# Altium project DC309A.PrjPcb (part 5 of 7)

## Sheet DC309A_CLKGen.SchDoc: CLKGen
size 558 x 431 mm; Date: Not shown in title block; ApprovedBy: Not shown in title block; CheckedBy: Not shown in title block; Author: Not shown in title block; CompanyName: Not shown in title block; DrawnBy: KAVIKANNAN; Engineer: Not shown in title block; Organization: Not shown in title block; Address1: Not shown in title block; Address2: Not shown in title block; Address3: Not shown in title block; Address4: Not shown in title block; DocumentNumber: 7; Revision: Use project parameter SCH_Rev; SheetNumber: 7; SheetTotal: 11; PageSetup: Record=PageOptions|CenterHorizontal=True|CenterVertical=True|PrintScale=1.00|XCorrection=1.00|YCorrection=1.00|PrintKind=0|BorderSize=5000000|LeftOffset=0|BottomOffset=0|Orientation=2|PaperLength=1000|PaperWidth=1000|Scale=100|PaperSource=15|PrintQuality=600|MediaType=1|DitherType=10|PaperKind=Letter|PrintScaleMode=1; CurrentTime: Not shown in title block; CurrentDate: Not shown in title block; Time: Not shown in title block; DocumentFullPathAndName: Not shown in title block; DocumentName: Not shown in title block; ModifiedDate: Not shown in title block; ImagePath: Not shown in title block
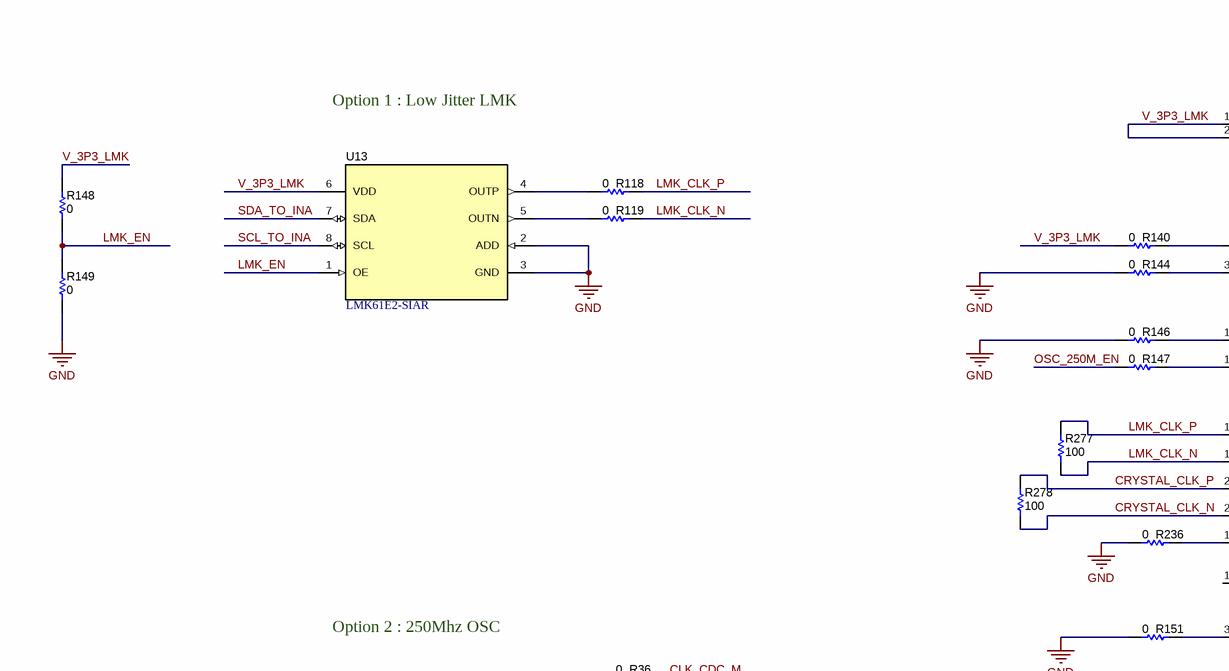
[diagram p20: DC309A_CLKGen.SchDoc, top left]
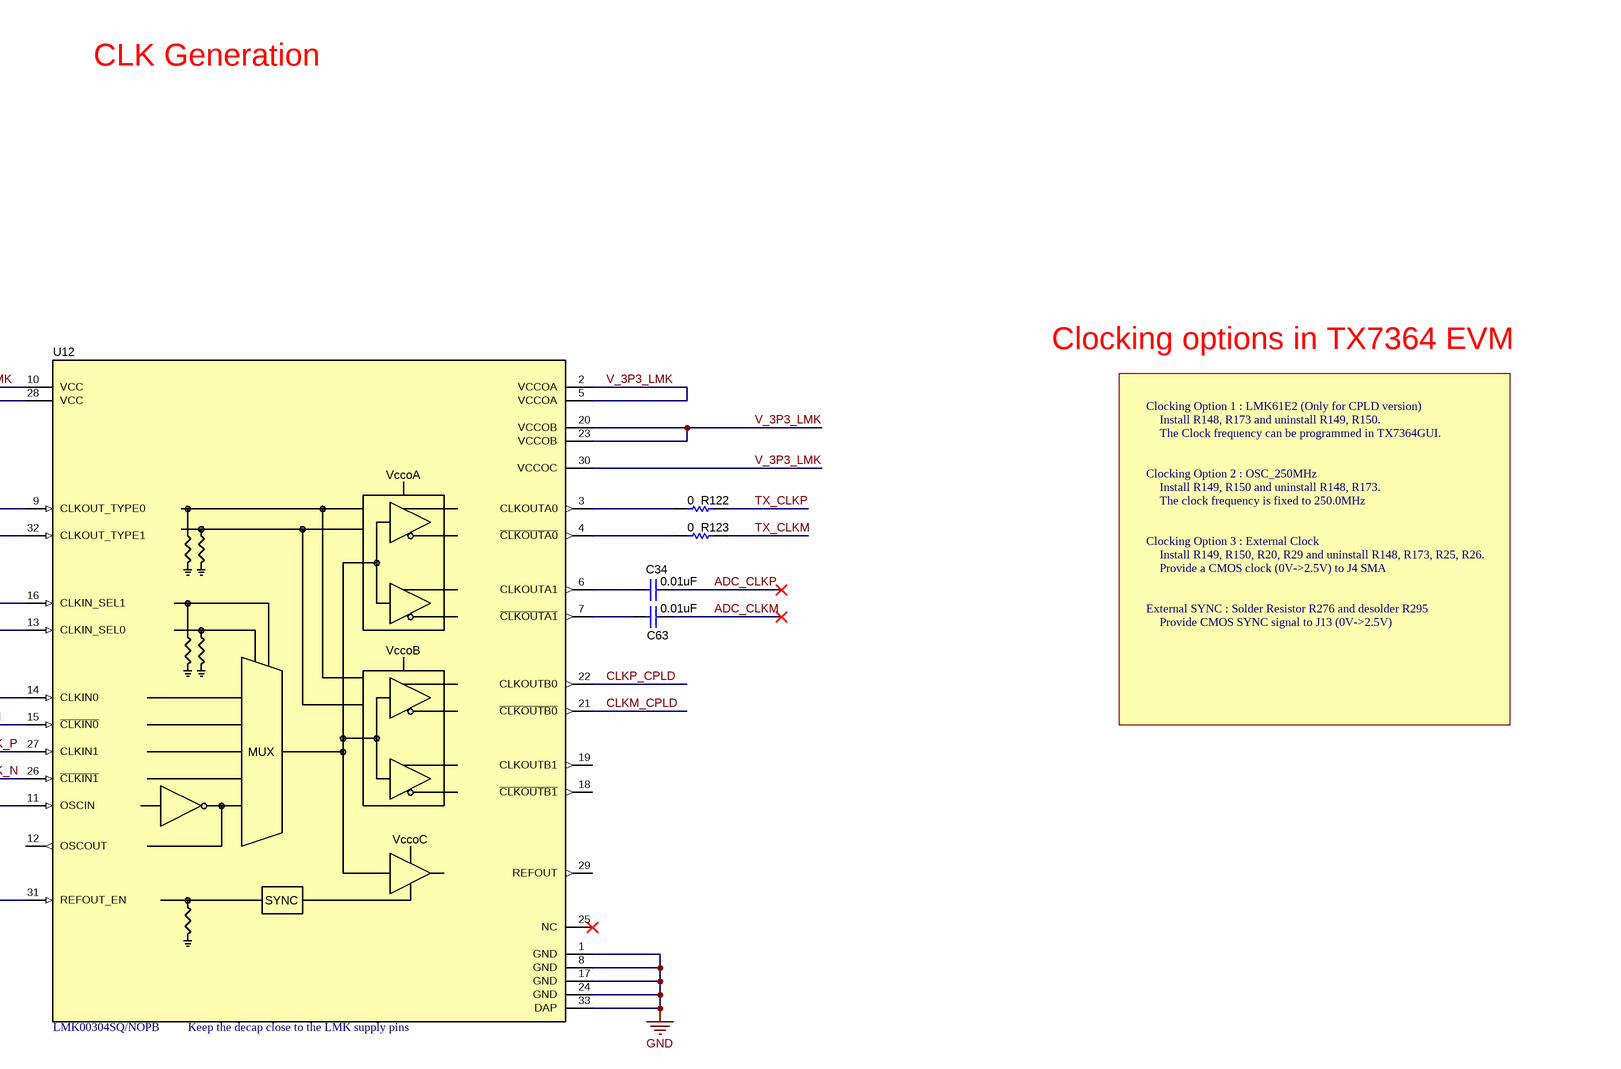
[diagram p21: DC309A_CLKGen.SchDoc, top right]
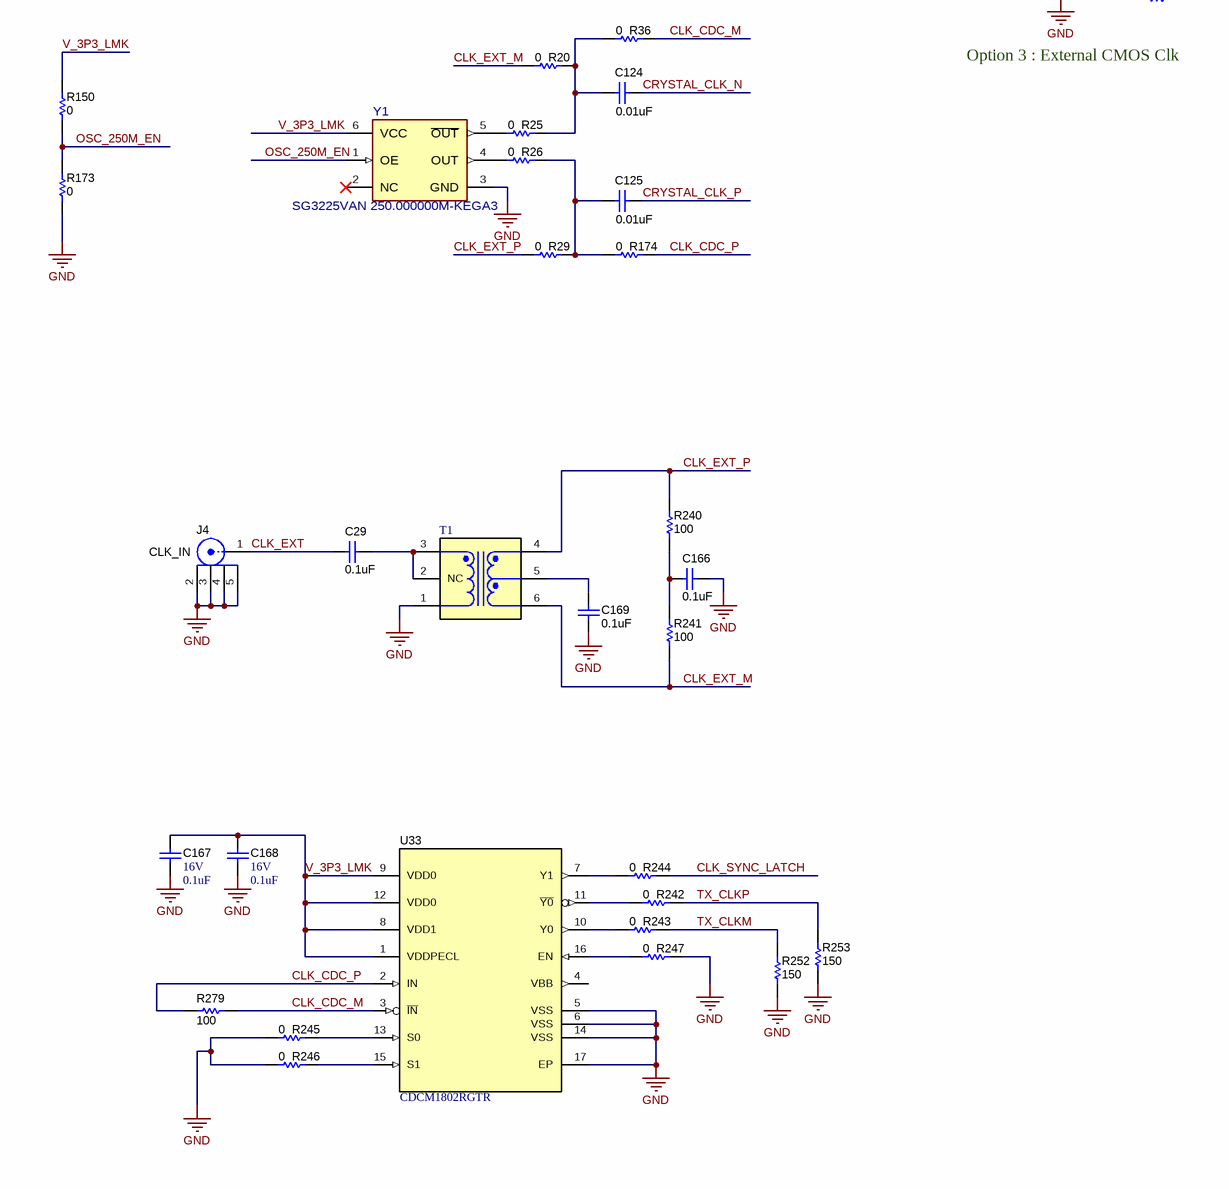
[diagram p22: DC309A_CLKGen.SchDoc, bottom left]
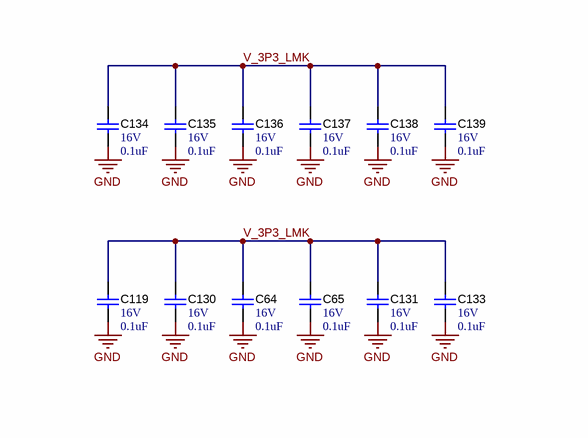
[diagram p23: DC309A_CLKGen.SchDoc, bottom right]

### Parts
C29  ValueDisplayed: 0.1uF  [0402]  (hidden comment: Capacitor)
C34  ValueDisplayed: 0.01uF  [0402_065]  (hidden comment: 520L103KT16T)
C63  ValueDisplayed: 0.01uF  [0402_065]  (hidden comment: 520L103KT16T)
C64  VDC_V: 16V  ValueDisplayed: 0.1uF  [0402]  (hidden comment: 0402YC104KAT2A)
C65  VDC_V: 16V  ValueDisplayed: 0.1uF  [0402]  (hidden comment: 0402YC104KAT2A)
C119  VDC_V: 16V  ValueDisplayed: 0.1uF  [0402]  (hidden comment: 0402YC104KAT2A)
C124  ValueDisplayed: 0.01uF  [0402_065]  (hidden comment: 520L103KT16T)
C125  ValueDisplayed: 0.01uF  [0402_065]  (hidden comment: 520L103KT16T)
C130  VDC_V: 16V  ValueDisplayed: 0.1uF  [0402]  (hidden comment: 0402YC104KAT2A)
C131  VDC_V: 16V  ValueDisplayed: 0.1uF  [0402]  (hidden comment: 0402YC104KAT2A)
C133  VDC_V: 16V  ValueDisplayed: 0.1uF  [0402]  (hidden comment: 0402YC104KAT2A)
C134  VDC_V: 16V  ValueDisplayed: 0.1uF  [0402]  (hidden comment: 0402YC104KAT2A)
C135  VDC_V: 16V  ValueDisplayed: 0.1uF  [0402]  (hidden comment: 0402YC104KAT2A)
C136  VDC_V: 16V  ValueDisplayed: 0.1uF  [0402]  (hidden comment: 0402YC104KAT2A)
C137  VDC_V: 16V  ValueDisplayed: 0.1uF  [0402]  (hidden comment: 0402YC104KAT2A)
C138  VDC_V: 16V  ValueDisplayed: 0.1uF  [0402]  (hidden comment: 0402YC104KAT2A)
C139  VDC_V: 16V  ValueDisplayed: 0.1uF  [0402]  (hidden comment: 0402YC104KAT2A)
C166  ValueDisplayed: 0.1uF  [0402]  (hidden comment: Capacitor)
C167  VDC_V: 16V  ValueDisplayed: 0.1uF  [0402]  (hidden comment: 0402YC104KAT2A)
C168  VDC_V: 16V  ValueDisplayed: 0.1uF  [0402]  (hidden comment: 0402YC104KAT2A)
C169  ValueDisplayed: 0.1uF  [0402]  (hidden comment: Capacitor)
J4  901-144-8RFX  [AMPHENOL_901-144-8RFX]  (value not drawn)
R20  Res_ohm: 0  [0402]  (hidden comment: Resistor)
R25  Res_ohm: 0  [0402]  (hidden comment: Resistor)
R26  Res_ohm: 0  [0402]  (hidden comment: Resistor)
R29  Res_ohm: 0  [0402]  (hidden comment: Resistor)
R36  Res_ohm: 0  [0402]  (hidden comment: Resistor)
R118  Res_ohm: 0  [0402]  (hidden comment: Resistor)
R119  Res_ohm: 0  [0402]  (hidden comment: Resistor)
R122  Res_ohm: 0  [0402]  (hidden comment: Resistor)
R123  Res_ohm: 0  [0402]  (hidden comment: Resistor)
R140  Res_ohm: 0  [0402]  (hidden comment: Resistor)
R144  Res_ohm: 0  [0402]  (hidden comment: Resistor)
R146  Res_ohm: 0  [0402]  (hidden comment: Resistor)
R147  Res_ohm: 0  [0402]  (hidden comment: Resistor)
R148  Res_ohm: 0  [0402]  (hidden comment: Resistor)
R149  Res_ohm: 0  [0402]  (hidden comment: Resistor)
R150  Res_ohm: 0  [0402]  (hidden comment: Resistor)
R151  Res_ohm: 0  [0402]  (hidden comment: Resistor)
R173  Res_ohm: 0  [0402]  (hidden comment: Resistor)
R174  Res_ohm: 0  [0402]  (hidden comment: Resistor)
R236  Res_ohm: 0  [0402]  (hidden comment: Resistor)
R240  ValueDisplayed: 100  [0402]  (hidden comment: Resistor)
R241  ValueDisplayed: 100  [0402]  (hidden comment: Resistor)
R242  Res_ohm: 0  [0402]  (hidden comment: Resistor)
R243  Res_ohm: 0  [0402]  (hidden comment: Resistor)
R244  Res_ohm: 0  [0402]  (hidden comment: Resistor)
R245  Res_ohm: 0  [0402]  (hidden comment: Resistor)
R246  Res_ohm: 0  [0402]  (hidden comment: Resistor)
R247  Res_ohm: 0  [0402]  (hidden comment: Resistor)
R252  ValueDisplayed: 150  [0603]  (hidden comment: RT0603BRD07150RL)
R253  ValueDisplayed: 150  [0603]  (hidden comment: RT0603BRD07150RL)
R277  ValueDisplayed: 100  [0402]  (hidden comment: Resistor)
R278  ValueDisplayed: 100  [0402]  (hidden comment: Resistor)
R279  ValueDisplayed: 100  [0402]  (hidden comment: Resistor)
T1  MNC_ADT4-1WT+  [MNC_CD542]  (value not drawn)
U12  LMK00304SQ/NOPB  [RTV0032A]
U13  LMK61E2-SIAR  [SIA0008B]
U33  CDCM1802RGTR  [RGT0016A]
Y1  SG3225VAN 250.000000M-KEGA3  [FP-SG3225VAN 250.000000M-KEGA3_XTAL_SMD_3MM2_2MM5-MFG]

### Nets
GND: C64.2 C65.2 C119.2 C130.2 C131.2 C133.2 C134.2 C135.2 C136.2 C137.2 C138.2 C139.2 C166.1 C167.2 C168.2 C169.1 J4.2 J4.3 J4.4 J4.5 R144.1 R146.1 R149.1 R151.1 R173.1 R236.1 R245.1 R246.1 R247.2 R252.1 R253.1 T1.1 U12.1(GND) U12.8(GND) U12.17(GND) U12.24(GND) U12.33(DAP) U13.2(ADD) U13.3(GND) U33.5(VSS) U33.6(VSS) U33.14(VSS) U33.17(EP) Y1.3(GND)
ADC_CLKM: C63.1
ADC_CLKP: C34.1
CLK_CDC_M: R36.2 R279.2 U33.3(~{IN})
CLK_CDC_P: R174.2 R279.1 U33.2(IN)
CLK_EXT: C29.1 J4.1
CLK_EXT_M: R20.1 R241.1 T1.6
CLK_EXT_P: R29.1 R240.2 T1.4
CLK_SYNC_LATCH: R244.2
CLKM_CPLD: U12.21(~{CLKOUTB0})
CLKP_CPLD: U12.22(CLKOUTB0)
CRYSTAL_CLK_N: C124.1 R278.1 U12.26(~{CLKIN1})
CRYSTAL_CLK_P: C125.1 R278.2 U12.27(CLKIN1)
LMK_CLK_N: R119.2 R277.1 U12.15(~{CLKIN0})
LMK_CLK_P: R118.2 R277.2 U12.14(CLKIN0)
LMK_EN: R148.1 R149.2 U13.1(OE)
OSC_250M_EN: R147.1 R150.1 R173.2 Y1.1(OE)
SCL_TO_INA: U13.8(SCL)
SDA_TO_INA: U13.7(SDA)
TX_CLKM: R123.2 R243.2 R252.2
TX_CLKP: R122.2 R242.2 R253.2
V_3P3_LMK: C64.1 C65.1 C119.1 C130.1 C131.1 C133.1 C134.1 C135.1 C136.1 C137.1 C138.1 C139.1 C167.1 C168.1 R140.1 R148.2 R150.2 U12.2(VCCOA) U12.5(VCCOA) U12.10(VCC) U12.20(VCCOB) U12.23(VCCOB) U12.28(VCC) U12.30(VCCOC) U13.6(VDD) U33.1(VDDPECL) U33.8(VDD1) U33.9(VDD0) U33.12(VDD0) Y1.6(VCC)
NetC29_2: C29.2 T1.2(NC) T1.3
NetC34_2: C34.2 U12.6(CLKOUTA1)
NetC63_2: C63.2 U12.7(~{CLKOUTA1})
NetC124_2: C124.2 R20.2 R25.2 R36.1
NetC125_2: C125.2 R26.2 R29.2 R174.1
NetC166_2: C166.2 R240.1 R241.2
NetC169_2: C169.2 T1.5
NetR25_1: R25.1 Y1.5(~{OUT})
NetR26_1: R26.1 Y1.4(OUT)
NetR118_1: R118.1 U13.4(OUTP)
NetR119_1: R119.1 U13.5(OUTN)
NetR122_1: R122.1 U12.3(CLKOUTA0)
NetR123_1: R123.1 U12.4(~{CLKOUTA0})
NetR140_2: R140.2 U12.9(CLKOUT_TYPE0)
NetR144_2: R144.2 U12.32(CLKOUT_TYPE1)
NetR146_2: R146.2 U12.16(CLKIN_SEL1)
NetR147_2: R147.2 U12.13(CLKIN_SEL0)
NetR151_2: R151.2 U12.31(REFOUT_EN)
NetR236_2: R236.2 U12.11(OSCIN)
NetR242_1: R242.1 U33.11(~{Y0})
NetR243_1: R243.1 U33.10(Y0)
NetR244_1: R244.1 U33.7(Y1)
NetR245_2: R245.2 U33.13(S0)
NetR246_2: R246.2 U33.15(S1)
NetR247_1: R247.1 U33.16(EN)

Not connected (* = marked no-connect by the designer): U12 12(OSCOUT) 18(~{CLKOUTB1}) 19(CLKOUTB1) 25(NC)* 29(REFOUT); U33 4(VBB); Y1 2(NC)*

### Notes on the sheet
- CLK Generation
- Option 1 : Low Jitter LMK
- Clocking options in TX7364 EVM
- Clocking Option 1 : LMK61E2 (Only for CPLD version)
- Install R148, R173 and uninstall R149, R150.
- The Clock frequency can be programmed in TX7364GUI.
- Clocking Option 2 : OSC_250MHz
- Install R149, R150 and uninstall R148, R173.
- The clock frequency is fixed to 250.0MHz
- Clocking Option 3 : External Clock
- Install R149, R150, R20, R29 and uninstall R148, R173, R25, R26.
- Provide a CMOS clock (0V->2.5V) to J4 SMA
- External SYNC : Solder Resistor R276 and desolder R295
- Provide CMOS SYNC signal to J13 (0V->2.5V)
- Option 2 : 250Mhz OSC
- Option 3 : External CMOS Clk
- (near U12) Keep the decap close to the LMK supply pins
- (near J4) CLK_IN
- Drawn By:
- SVN Rev:
- Number:
- TID #:
- Orderable:
- Rev:
- Sheet Title:
- File:
- Project Title:
- Designed for:
- Assembly Variant:
- Mod. Date:
- Sheet:
- Size:
- of
- C
- http://www.ti.com
- Texas Instruments and/or its licensors do not warrant the accuracy or completeness of this specification or any information contained therein. Texas Instruments and/or its licensors do not warrant that this design will meet the specifications, will be suitable for your application or fit for any particular purpose, or will operate in an implementation. Texas Instruments and/or its licensors do not warrant that the design is production worthy. You should completely validate and test your design implementation to confirm the system functionality for your application.
- Engineer:
- Contact:
- © Texas Instruments
- (in symbol CMP-0065665-2) MUX; SYNC

### Library data of the parts
C29 C166 C169 = CMP-0006255-2: CAP, CERM, 0.1 uF, 6.3 V, +/- 10%, X5R, 0402; PartNumber: C1005X5R0J104K050BA; Manufacturer: TDK; Polarized: N; Value: 0.1uF; U/M: EA; Cap_F: 100nF; ESR_ohm: 0.0186; Value1: 0.0186 ohm; VDC_V: 6.3V; TaMin_C: -55°C; TaMax_C: 85°C; SizeArea_mm2: 0.5; SizeAreaWB_mm2: 3; SizeX_mm: 1; SizeZ_mm: 0.6; AEC Category: Q200; CompType: Capacitor; PackageReference: 0402; RoHS: Y; Tolerance_%: 10%; Value2: 6.3V; MountType: SMT; Technology: Ceramic; TempCo: X5R; Cap_Case: 0402; SizeY_mm: 0.5; Published: 2008-06-19; Publisher: Texas Instruments; LatestRevisionDate: 2017-03-09; ComponentLink1Description: Datasheet link; ComponentLink1URL: http://www.tdk.co.jp/tefe02/e412_c.pdf; Supplier 1: Digi-Key; Supplier Part Number 1: 445-1266-1-ND; Supplier 2: Newark; Supplier Part Number 2: 90R7579; Supplier 3: Mouser; Supplier Part Number 3: 810-C1005X5R0J104K; AEC Qualified: ?
C34 C63 C124 C125 = CMP-0006210-2: CAP, CERM, 0.01 uF, 16 V, +/- 10%, X7R, 0402; Manufacturer: AT Ceramics; TaMin_C: -55°C; Polarized: N; SizeAreaWB_mm2: 3; Value1: Unknown; U/M: EA; Value: 0.01uF; TaMax_C: 125°C; SizeZ_mm: 0.65; SizeX_mm: 1; SizeY_mm: 0.5; Cap_Case: 0402; Value2: 16V; CompType: Capacitor; Cap_F: 10nF; AEC Category: Q200; Supplier Part Number 2: 581-520L103KT16T; Publisher: Texas Instruments; Supplier 2: Mouser; TempCo: X7R; Published: 2008-06-19; RoHS: Y; MountType: SMT; Supplier 1: Digi-Key; PackageReference: 0402; Tolerance_%: 10%; SizeArea_mm2: 0.5; LatestRevisionDate: 2017-03-09; PartNumber: 520L103KT16T; AEC Qualified: N; VDC_V: 16V; ComponentLink1Description: Datasheet link; AEC Grade: N/A; Supplier Part Number 1: 1284-1540-1-ND; Technology: Ceramic; ComponentLink1URL: https://www.atceramics.com/UserFiles/520l.pdf
C64 C65 C119 C130 C131 C133-C139 C167 C168 = CMP-0006201-2: CAP, CERM, 0.1 uF, 16 V, +/- 10%, X7R, 0402; Manufacturer: AVX; TaMin_C: -55°C; Polarized: N; SizeAreaWB_mm2: 3; Value1: Unknown; U/M: EA; Value: 0.1uF; TaMax_C: 125°C; SizeZ_mm: 0.6; SizeX_mm: 1; SizeY_mm: 0.5; Cap_F: 100nF; AEC Category: Q200; ComponentLink1URL: http://catalogs.avx.com/SurfaceMount.pdf; Supplier Part Number 2: 09R7024; Publisher: Texas Instruments; Supplier 2: Newark; Supplier Part Number 3: 581-0402YC104KAT2A; TempCo: X7R; Supplier 3: Mouser; Published: 2008-06-19; RoHS: Y; MountType: SMT; Supplier 1: Digi-Key; PackageReference: 0402; Tolerance_%: 10%; Cap_Case: 0402; Value2: 16V; SizeArea_mm2: 0.5; CompType: Capacitor; LatestRevisionDate: 2017-03-09; PartNumber: 0402YC104KAT2A; AEC Qualified: N; ComponentLink1Description: Datasheet link; AEC Grade: N/A; Supplier Part Number 1: 478-7888-1-ND; Technology: Ceramic
J4 = CMP-0055833-1: SMA Straight Jack, Gold, 50 Ohm, TH; Manufacturer: Amphenol RF; CNHeader: FALSE; Green_Lifecycle: Not Set; Green_REACh: Incomplete; CT: TRUE; ComponentLink1URL: http://www.amphenolinfocom.eu/NavData/Drawings/C901-144-8RFX.pdf; Supplier Part Number 2: 34C8151; Publisher: Texas Instruments; Supplier 2: Newark; Supplier Part Number 3: 523-901-144-8RFX; Supplier 3: Mouser; RoHS: Y; MountType: TH; Green_EU RoHS-2: Incomplete; Supplier 1: Digi-Key; Green_EU RoHS: Incomplete; PackageReference: SMA Straight Jack, TH; CompType: SMA; LatestRevisionDate: 26/05/2017; PartNumber: 901-144-8RFX; ComponentLink1Description: Datasheet URL; Supplier Part Number 1: ARFX1231-ND
R20 R25 R26 R29 R36 R118 R119 R122 R123 R140 R144 R146-R151 R173 R174 R236 R242-R247 = CMP-0026992-3: RES, 0, 5%, 0.1 W, AEC-Q200 Grade 0, 0402; PartNumber: ERJ-2GE0R00X; Manufacturer: Panasonic; Value_Code: 0000; Power_W: 100mW; Value2: 0.1W; VDC_V: 50V; TempCo: 600 ppm/C; SizeArea_mm2: 0.5; SizeX_mm: 1; SizeZ_mm: 0.6; EIA_Code: E24; AEC Category: Q200; AEC Qualified: Y; SizeAreaWB_mm2: 3; CompType: Resistor; PackageReference: 0402; RoHS: Y; Tolerance_%: 5%; Value1: 5%; MountType: SMT; Technology: Thick Film; SizeY_mm: 0.5; ComponentLink1Description: Datasheet link; ComponentLink1URL: https://industrial.panasonic.com/cdbs/www-data/pdf/RDA0000/AOA0000C301.pdf; Supplier 1: Digi-Key; Supplier Part Number 1: P0.0JCT-ND; Supplier 2: Newark; Supplier Part Number 2: 65T8307; Supplier 3: Mouser; Supplier Part Number 3: 667-ERJ-2GE0R00X; AEC Grade: 0; ValueDisplayed: 0
R240 R241 R277-R279 = CMP-0026993-2: RES, 100, 5%, 0.1 W, AEC-Q200 Grade 0, 0402; PartNumber: ERJ-2GEJ101X; Manufacturer: Panasonic; Value: 100; Value_Code: 100R; Power_W: 100mW; Value2: 0.1W; TempCo: 200 ppm/C; SizeArea_mm2: 0.5; SizeX_mm: 1; SizeZ_mm: 0.6; EIA_Code: E24; U/M: EA; AEC Category: Q200; AEC Qualified: Y; AEC Grade: 0; CompType: Resistor; PackageReference: 0402; RoHS: Y; Res_ohm: 100; Tolerance_%: 5%; Value1: 5%; MountType: SMT; Technology: Thick Film; SizeY_mm: 0.5; Published: 2008-06-26; Publisher: Texas Instruments; LatestRevisionDate: 2017-03-09; ComponentLink1Description: Datasheet link; ComponentLink1URL: https://industrial.panasonic.com/cdbs/www-data/pdf/RDA0000/AOA0000C84.pdf; Supplier 1: Digi-Key; Supplier Part Number 1: P100JCT-ND; Supplier 2: Newark; Supplier Part Number 2: 65T8246; Supplier 3: Farnell; Supplier Part Number 3: 2059210
R252 R253 = CMP-0023767-2: RES, 150, 0.1%, 0.1 W, 0603; Manufacturer: Yageo America; Power_W: 100mW; TempCo: 25 ppm/C; Value_Code: 150R; U/M: EA; Value: 150; EIA_Code: E192; SizeX_mm: 1.6; SizeY_mm: 0.8; SizeZ_mm: 1; Value2: 0.1W; SizeArea_mm2: 1.28; VDC_V: 75V; AEC Category: Q200; Publisher: Texas Instruments; Published: 2008-06-26; RoHS: Y; Value1: 0.1%; MountType: SMT; PackageReference: 0603; Tolerance_%: 0.1%; Res_ohm: 150; CompType: Resistor; LatestRevisionDate: 2017-03-09; PartNumber: RT0603BRD07150RL; AEC Qualified: ?; ComponentLink1Description: Datasheet link; Technology: Thin Film; ComponentLink1URL: http://www.yageo.com/pdf/PYu-RT_1-to-0.05_RoHS_L_3.pdf
T1 = CMP-0030461-2: RF Transformer, 50 ohm, 2 to 775 MHz, SMT; Manufacturer: Minicircuits; Green_Lifecycle: Not Set; Green_REACh: Incomplete; PartNumber: ADT4-1WT+; MountType: SMT; PackageReference: CD542; RoHS: Y; ComponentLink1URL: http://www.minicircuits.com/pdfs/ADT4-1WT.pdf; ComponentLink1Description: Datasheet URL; CompType: Transformer; Publisher: Texas Instruments; LatestRevisionDate: 2017-05-09; Green_EU RoHS-2: Incomplete; Green_EU RoHS: Incomplete
U12 = CMP-0065665-2: 3.1-GHz Differential Clock Buffer/Level Translator, RTV0032A (WQFN-32); Alternate Manufacturer: Texas Instruments; SizeAreaWB_mm2: 49.0; SizeArea_mm2: 25.0; SizeX_mm: 5.0; Green_REACh: Passed; SizeZ_mm: 0.8; AEC Category: Q200; Green_Lifecycle: Active; CompType: IC; AEC Qualified: N; ComponentLink1Description: Datasheet Link; ComponentLink2URL: http://www.ti.com/product/lmk00304; PartNumber: LMK00304SQ/NOPB; ComponentLink3Description: Online Datasheet; ComponentLink1URL: http://www.ti.com/lit/ds/symlink/lmk00304.pdf; PackageReference: RTV0032A; ComponentLink2Description: Product Folder; Green_EU RoHS-2: Passed; RoHS: Y; Green_EU RoHS: Passed; ComponentLink3URL: http://www.ti.com/product/lmk00304/datasheet; PackageDescription: WQFN-32; Operating Temperature Range: -40 to 85 C; SizeY_mm: 5.0; Manufacturer: Texas Instruments; MountType: SMT
U13 = CMP-0075884-1: Ultra-Low Jitter Fully Programmable Oscillator, Integrated EEPROM, +/-50ppm, SIA0008B (QFM-8); Manufacturer: Texas Instruments; Alternate PartNumber: LMK61E2-SIAT; SizeAreaWB_mm2: 20.25; SizeArea_mm2: 12.25; SizeZ_mm: 2.0; SizeY_mm: 3.5; U/M: EA; CompType: IC; ComponentLink1Description: Datasheet Link; RoHS: Y; PackageReference: SIA0008B; PartNumber: LMK61E2-SIAR; Publisher: Texas Instruments; PackageDescription: QFM-8; Alternate Manufacturer: Texas Instruments; ComponentLink1URL: http://www.ti.com/lit/ds/symlink/lmk61e2.pdf; LatestRevisionDate: 2017-06-09; MountType: SMT; SizeX_mm: 3.5
U33 = CMP-0065659-2: Clock Buffer w/Programmable Divider, LVPECL I/O + addl LVCMOS output, RGT0016A (VQFN-16); Alternate PartNumber: CDCM1802RGTT; Alternate Manufacturer: Texas Instruments; SizeAreaWB_mm2: 25.0; U/M: EA; SizeZ_mm: 1.0; SizeX_mm: 4.0; SizeArea_mm2: 16.0; CompType: IC; ComponentLink1URL: http://www.ti.com/lit/ds/symlink/cdcm1802.pdf; Publisher: Texas Instruments; PackageDescription: VQFN-16; RoHS: Y; MountType: SMT; Manufacturer: Texas Instruments; PackageReference: RGT0016A; SizeY_mm: 4.0; LatestRevisionDate: 2017-06-09; PartNumber: CDCM1802RGTR; ComponentLink1Description: Datasheet Link
Y1 = CMP-0087650-1: XTAL OSC XO 250.0000MHZ LVDS SMD; Manufacturer: EPSON; AEC Qualified: No; Frequency_Fixed: 250MHz; SizeZ_mm: 1.2mm; ComponentLink1Description: Datasheet; RoHS: TRUE; PartNumber: SG3225VAN 250.000000M-KEGA3; Symbol Name: SYM-SG3225VAN 250.000000M-KEGA3; ComponentLink1URL: https://support.epson.biz/td/api/doc_check.php?dl=brief_SG5032VAN&lang=en; PackageReference: XTAL_SMD_3MM2_2MM5

## Sheet DC309A_External_Sync.SchDoc: External_Sync
size 558 x 431 mm; Date: Not shown in title block; ApprovedBy: Not shown in title block; CheckedBy: Not shown in title block; Author: Not shown in title block; CompanyName: Not shown in title block; DrawnBy: KAVIKANNAN; Engineer: Not shown in title block; Organization: Not shown in title block; Address1: Not shown in title block; Address2: Not shown in title block; Address3: Not shown in title block; Address4: Not shown in title block; DocumentNumber: 8; Revision: Use project parameter SCH_Rev; SheetNumber: 8; SheetTotal: 11; PageSetup: Record=PageOptions|CenterHorizontal=True|CenterVertical=True|PrintScale=1.00|XCorrection=1.00|YCorrection=1.00|PrintKind=0|BorderSize=5000000|LeftOffset=0|BottomOffset=0|Orientation=2|PaperLength=1000|PaperWidth=1000|Scale=100|PaperSource=15|PrintQuality=600|MediaType=1|DitherType=10|PaperKind=Letter|PrintScaleMode=1; CurrentTime: Not shown in title block; CurrentDate: Not shown in title block; Time: Not shown in title block; DocumentFullPathAndName: Not shown in title block; DocumentName: Not shown in title block; ModifiedDate: Not shown in title block; ImagePath: Not shown in title block
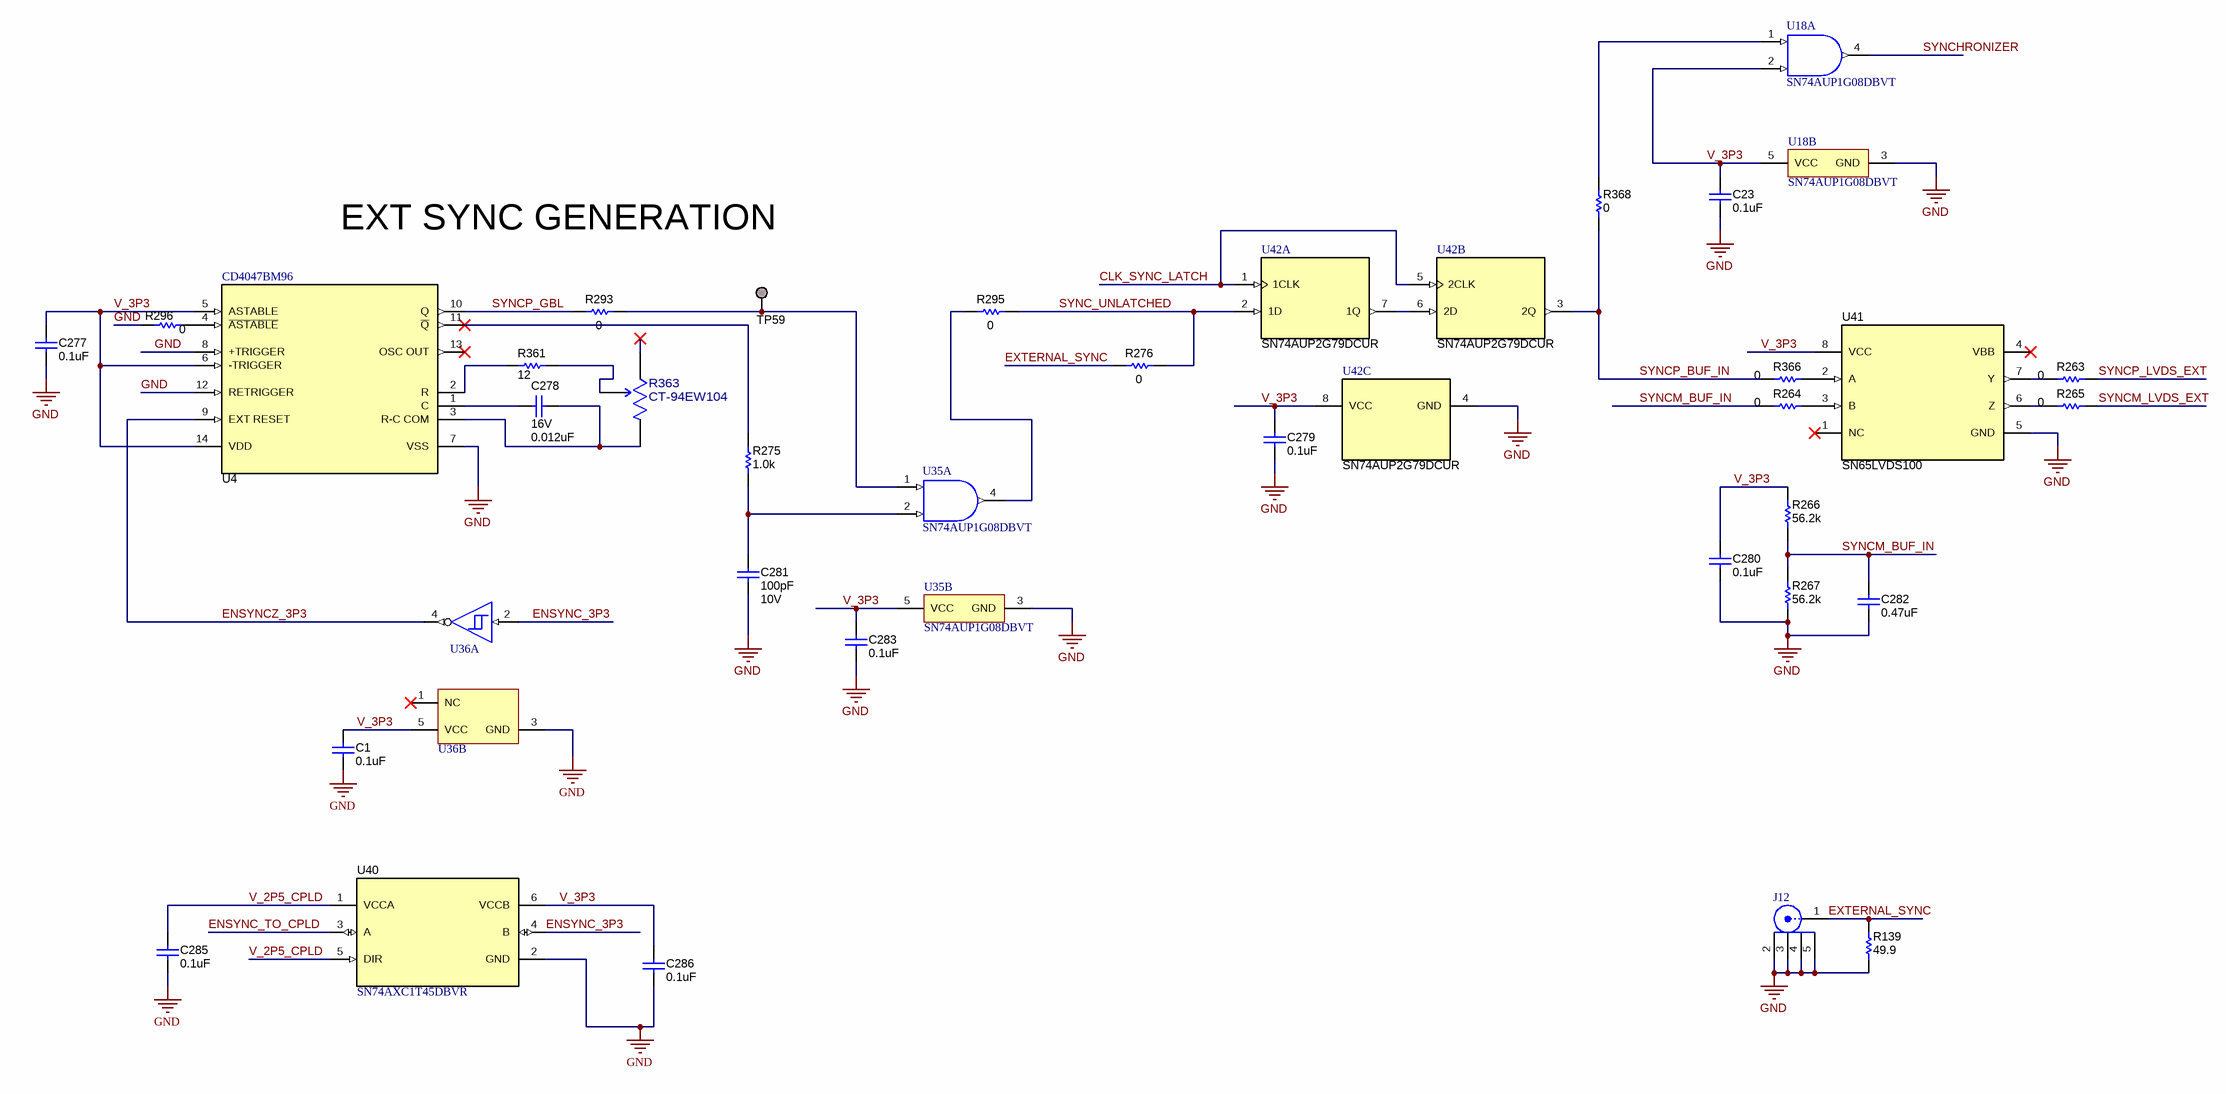
[diagram p24: DC309A_External_Sync.SchDoc]

### Parts
C1  value 0.1uF  [0402]  (hidden comment: Capacitor)
C23  ValueDisplayed: 0.1uF  [0402]  (hidden comment: Capacitor)
C277  ValueDisplayed: 0.1uF  [0402]  (hidden comment: Capacitor)
C278  VDC_V: 16V  ValueDisplayed: 0.012uF  [0402]  (hidden comment: GRM155R71C123KA01D)
C279  ValueDisplayed: 0.1uF  [0402]  (hidden comment: Capacitor)
C280  ValueDisplayed: 0.1uF  [0402]  (hidden comment: Capacitor)
C281  Cap_F: 100pF  VDC_V: 10V  [0603]  (hidden comment: 0603ZC101KAT2A)
C282  ValueDisplayed: 0.47uF  [0402]  (hidden comment: Capacitor)
C283  ValueDisplayed: 0.1uF  [0402]  (hidden comment: Capacitor)
C285  value 0.1uF  [0402]  (hidden comment: Capacitor)
C286  value 0.1uF  [0402]  (hidden comment: Capacitor)
J12  901-144-8RFX  [AMPHENOL_901-144-8RFX]  (value not drawn)
R139  ValueDisplayed: 49.9  [TNPW0603]  (hidden comment: TNPW060349R9BEEA)
R263  value 0  [0402]  (hidden comment: Resistor)
R264  value 0  [0402]  (hidden comment: Resistor)
R265  value 0  [0402]  (hidden comment: Resistor)
R266  ValueDisplayed: 56.2k  [0402]  (hidden comment: Resistor)
R267  ValueDisplayed: 56.2k  [0402]  (hidden comment: Resistor)
R275  ValueDisplayed: 1.0k  [0402]  (hidden comment: CRCW04021K00JNED)
R276  value 0  [0402]  (hidden comment: Resistor)
R293  value 0  [0402]  (hidden comment: Resistor)
R295  value 0  [0402]  (hidden comment: Resistor)
R296  ValueDisplayed: 0  [0402]  (hidden comment: Resistor)
R361  ValueDisplayed: 12  [0402]  (hidden comment: CRCW040212R0JNED)
R363  CT-94EW104  [FP-CT-94EW104_PTH_POTEN_9MM6_4MM8-MFG]
R366  value 0  [0402]  (hidden comment: Resistor)
R368  value 0  [0402]  (hidden comment: Resistor)
TP59  Test Point  [TP_50MIL-SMT]  (value not drawn)  (no BOM)
U4  CD4047BM96  [D0014A_N]
U18  SN74AUP1G08DBVT  [DBV0005A_N]  (parts A,B of 2)
U35  SN74AUP1G08DBVT  [DBV0005A_N]  (parts A,B of 2)
U36  SN74LVC1G14DBVR  [DBV0005A_N]  (value not drawn)  (parts A,B of 2)
U40  SN74AXC1T45DBVR  [DBV0006A_N]
U41  SN65LVDS100  [DGK0008A_N]
U42  SN74AUP2G79DCUR  [DCU0008A_N]  (parts A,B,C of 3)

### Nets
GND: C1.1 C23.2 C277.2 C279.2 C280.2 C281.1 C282.2 C283.2 C285.1 C286.1 J12.2 J12.3 J12.4 J12.5 R139.1 R267.1 R296.1 U4.7(VSS) U4.8(+TRIGGER) U4.12(RETRIGGER) U18.3(GND) U35.3(GND) U36.3(GND) U40.2(GND) U41.5(GND) U42.4(GND)
V_3P3: C1.2 C23.1 C277.1 C279.1 C280.1 C283.1 C286.2 R266.2 U4.5(ASTABLE) U4.6(-TRIGGER) U4.14(VDD) U18.2(B) U18.5(VCC) U35.5(VCC) U36.5(VCC) U40.6(VCCB) U41.8(VCC) U42.8(VCC)
CLK_SYNC_LATCH: U42.1(1CLK) U42.5(2CLK)
ENSYNC_3P3: U36.2(A) U40.4(B)
ENSYNC_TO_CPLD: U40.3(A)
ENSYNCZ_3P3: U4.9(EXT_RESET) U36.4(Y)
EXTERNAL_SYNC: J12.1 R139.2 R276.2
SYNC_UNLATCHED: R276.1 R295.1 U42.2(1D)
SYNCHRONIZER: U18.4(Y)
SYNCM_BUF_IN: C282.1 R264.2 R266.1 R267.2
SYNCM_LVDS_EXT: R265.1
SYNCP_BUF_IN: R366.2 R368.1 U42.3(2Q)
SYNCP_GBL: R293.2 U4.10(Q)
SYNCP_LVDS_EXT: R263.1
V_2P5_CPLD: C285.2 U40.1(VCCA) U40.5(DIR)
NetC278_1: C278.1 R363.3 U4.3(R-C_COM)
NetC278_2: C278.2 U4.1(C)
NetC281_2: C281.2 R275.2 U35.2(B)
NetR263_2: R263.2 U41.7(Y)
NetR264_1: R264.1 U41.3(B)
NetR265_2: R265.2 U41.6(Z)
NetR275_1: R275.1 U4.11(~{Q})
NetR293_1: R293.1 TP59.1 U35.1(A)
NetR295_2: R295.2 U35.4(Y)
NetR296_2: R296.2 U4.4(~{ASTABLE})
NetR361_1: R361.1 U4.2(R)
NetR361_2: R361.2 R363.2
NetR366_1: R366.1 U41.2(A)
NetR368_2: R368.2 U18.1(A)
NetU42_6: U42.6(2D) U42.7(1Q)

Not connected (* = marked no-connect by the designer): R363 1*; U4 13(OSC_OUT)*; U36 1(NC)*; U41 1(NC)* 4(VBB)*

### Notes on the sheet
- EXT SYNC GENERATION
- Drawn By:
- SVN Rev:
- Number:
- TID #:
- Orderable:
- Rev:
- Sheet Title:
- File:
- Project Title:
- Designed for:
- Assembly Variant:
- Mod. Date:
- Sheet:
- Size:
- of
- C
- http://www.ti.com
- Texas Instruments and/or its licensors do not warrant the accuracy or completeness of this specification or any information contained therein. Texas Instruments and/or its licensors do not warrant that this design will meet the specifications, will be suitable for your application or fit for any particular purpose, or will operate in an implementation. Texas Instruments and/or its licensors do not warrant that the design is production worthy. You should completely validate and test your design implementation to confirm the system functionality for your application.
- Engineer:
- Contact:
- © Texas Instruments

### Library data of the parts
C1 C285 C286 = CMP-0006641-2: CAP, CERM, 0.1 uF, 16 V, +/- 10%, X7R, 0402; PartNumber: GRM155R71C104KA88D; Manufacturer: MuRata; Polarized: N; U/M: EA; Cap_F: 100nF; Value1: Unknown; VDC_V: 16V; TaMin_C: -55°C; TaMax_C: 125°C; AEC Category: Q200; SizeArea_mm2: 0.5; SizeAreaWB_mm2: 3; SizeX_mm: 1; SizeZ_mm: 0.6; CompType: Capacitor; PackageReference: 0402; RoHS: Y; MountType: SMT; ComponentLink1Description: Datasheet link; ComponentLink1URL: http://search.murata.co.jp/Ceramy/PnsearchViewAction.do?HnOFG=ON&HnNFG=ON&SEL_CNT=50&sLang=en&sKey=GRM155R71C104KA88D&x=9&y=9&search=startwith; ValueDisplayed: 0.1uF; Tolerance_%: 10%; Value2: 16V; Technology: Ceramic; TempCo: X7R; Cap_Case: 0402; Published: 2008-06-19; Publisher: Texas Instruments; LatestRevisionDate: 2017-03-09; Supplier 1: Digi-Key; Supplier Part Number 1: 490-3261-1-ND; Supplier 2: Newark; Supplier Part Number 2: 38K1647; Supplier 3: Mouser; Supplier Part Number 3: 81-GRM155R71C104KA88; AEC Qualified: ?; SizeY_mm: 0.5
C23 C279 C280 C283 = CMP-0006201-2: CAP, CERM, 0.1 uF, 16 V, +/- 10%, X7R, 0402; PartNumber: 0402YC104KAT2A; Manufacturer: AVX; Polarized: N; Value: 0.1uF; U/M: EA; Cap_F: 100nF; Value1: Unknown; VDC_V: 16V; TaMin_C: -55°C; TaMax_C: 125°C; SizeArea_mm2: 0.5; SizeAreaWB_mm2: 3; SizeX_mm: 1; SizeZ_mm: 0.6; AEC Category: Q200; CompType: Capacitor; PackageReference: 0402; RoHS: Y; Tolerance_%: 10%; Value2: 16V; MountType: SMT; Technology: Ceramic; TempCo: X7R; Cap_Case: 0402; SizeY_mm: 0.5; Published: 2008-06-19; Publisher: Texas Instruments; LatestRevisionDate: 2017-03-09; ComponentLink1Description: Datasheet link; ComponentLink1URL: http://catalogs.avx.com/SurfaceMount.pdf; Supplier 1: Digi-Key; Supplier Part Number 1: 478-7888-1-ND; Supplier 2: Newark; Supplier Part Number 2: 09R7024; Supplier 3: Mouser; Supplier Part Number 3: 581-0402YC104KAT2A; AEC Qualified: N; AEC Grade: N/A
C277 = CMP-0006255-2: as C29 on sheet DC309A_CLKGen; CompType: Capacitor; PackageReference: 0402; RoHS: Y; Tolerance_%: 10%; Value2: 6.3V; MountType: SMT; Technology: Ceramic; TempCo: X5R; Cap_Case: 0402; SizeY_mm: 0.5; Published: 2008-06-19; Publisher: Texas Instruments; LatestRevisionDate: 2017-03-09; ComponentLink1Description: Datasheet link; ComponentLink1URL: http://www.tdk.co.jp/tefe02/e412_c.pdf; Supplier 1: Digi-Key; Supplier Part Number 1: 445-1266-1-ND; Supplier 2: Newark; Supplier Part Number 2: 90R7579; Supplier 3: Mouser; Supplier Part Number 3: 810-C1005X5R0J104K; AEC Qualified: ?
C278 = CMP-0006642-2: CAP, CERM, 0.012 uF, 16 V, +/- 10%, X7R, 0402; Manufacturer: MuRata; TaMin_C: -55°C; Polarized: N; SizeAreaWB_mm2: 3; Value1: Unknown; U/M: EA; TaMax_C: 125°C; SizeZ_mm: 0.6; SizeX_mm: 1; SizeY_mm: 0.5; Cap_F: 12nF; AEC Category: Q200; Supplier Part Number 2: 81-GRM155R71C123KA1D; Publisher: Texas Instruments; Supplier 2: Mouser; TempCo: X7R; Published: 2008-06-19; RoHS: Y; MountType: SMT; Value: 0.012uF; Supplier 1: Digi-Key; PackageReference: 0402; Tolerance_%: 10%; Cap_Case: 0402; Value2: 16V; SizeArea_mm2: 0.5; CompType: Capacitor; LatestRevisionDate: 2017-03-09; PartNumber: GRM155R71C123KA01D; AEC Qualified: ?; ComponentLink1Description: Datasheet link; Supplier Part Number 1: 490-3255-1-ND; Technology: Ceramic; ComponentLink1URL: http://search.murata.co.jp/Ceramy/PnsearchViewAction.do?HnOFG=ON&HnNFG=ON&SEL_CNT=50&sLang=en&sKey=GRM155R71C123KA01D&x=9&y=9&search=startwith
C281 = CMP-0006812-2: CAP, CERM, 100 pF, 10 V, +/- 10%, X7R, 0603; Manufacturer: AVX; TaMin_C: -55°C; Polarized: N; SizeAreaWB_mm2: 4.68; Value1: Unknown; U/M: EA; Value: 100pF; TaMax_C: 125°C; SizeZ_mm: 1; SizeX_mm: 1.6; SizeY_mm: 0.8; SizeArea_mm2: 1.28; AEC Category: Q200; Supplier Part Number 2: 55J2751; Publisher: Texas Instruments; Supplier 2: Newark; Supplier Part Number 3: 581-0603ZC101KAT2A; TempCo: X7R; Supplier 3: Mouser; Published: 2008-06-19; RoHS: Y; MountType: SMT; Supplier 1: Digi-Key; PackageReference: 0603; Tolerance_%: 10%; Cap_Case: 0603; Value2: 10V; CompType: Capacitor; LatestRevisionDate: 2017-03-09; PartNumber: 0603ZC101KAT2A; AEC Qualified: N; ComponentLink1Description: Datasheet link; AEC Grade: N/A; Supplier Part Number 1: 0603ZC101KAT2A-ND; Technology: Ceramic; ValueDisplayed: 100pF; ComponentLink1URL: http://datasheets.avx.com/X7RDielectric.pdf
C282 = CMP-0006199-2: CAP, CERM, 0.47 uF, 6.3 V, +/- 10%, X5R, 0402; PartNumber: 04026D474KAT2A; Manufacturer: AVX; Polarized: N; Value: 0.47uF; U/M: EA; Cap_F: 470nF; Value1: Unknown; VDC_V: 6.3V; TaMin_C: -55°C; TaMax_C: 85°C; SizeArea_mm2: 0.5; SizeAreaWB_mm2: 3; SizeX_mm: 1; SizeZ_mm: 0.6; AEC Category: Q200; CompType: Capacitor; PackageReference: 0402; RoHS: Y; Tolerance_%: 10%; Value2: 6.3V; MountType: SMT; Technology: Ceramic; TempCo: X5R; Cap_Case: 0402; SizeY_mm: 0.5; Published: 2008-06-19; Publisher: Texas Instruments; LatestRevisionDate: 2017-03-09; ComponentLink1Description: Datasheet link; ComponentLink1URL: http://catalogs.avx.com/SurfaceMount.pdf; Supplier 1: Digi-Key; Supplier Part Number 1: 478-6196-1-ND; Supplier 2: Newark; Supplier Part Number 2: 60R6163; Supplier 3: Mouser; Supplier Part Number 3: 581-04026D474KAT2A; AEC Qualified: N; AEC Grade: N/A
J12 = CMP-0055833-1: as J4 on sheet DC309A_CLKGen; ComponentLink1URL: http://www.amphenolinfocom.eu/NavData/Drawings/C901-144-8RFX.pdf; Supplier Part Number 2: 34C8151; Publisher: Texas Instruments; Supplier 2: Newark; Supplier Part Number 3: 523-901-144-8RFX; Supplier 3: Mouser; RoHS: Y; MountType: TH; Green_EU RoHS-2: Incomplete; Supplier 1: Digi-Key; Green_EU RoHS: Incomplete; PackageReference: SMA Straight Jack, TH; CompType: SMA; LatestRevisionDate: 26/05/2017; PartNumber: 901-144-8RFX; ComponentLink1Description: Datasheet URL; Supplier Part Number 1: ARFX1231-ND
R139 = CMP-0025693-1: RES, 49.9, 0.1%, 0.1 W, AEC-Q200 Grade 1, 0603; Manufacturer: Vishay-Dale; Power_W: 100mW; TempCo: 25 ppm/C; Value_Code: 49R9; U/M: EA; Value: 49.9; EIA_Code: E192; SizeX_mm: 1.6; SizeY_mm: 0.85; SizeZ_mm: 0.55; Value2: 0.1W; SizeArea_mm2: 1.36; AEC Qualified: Y; VDC_V: 75V; AEC Grade: 1; AEC Category: Q200; ComponentLink1URL: http://www.vishay.com/docs/28758/tnpw_e3.pdf; Supplier Part Number 2: 05R4782; Publisher: Texas Instruments; Supplier 2: Newark; Supplier Part Number 3: 71-TNPW060349R9BEEA; Supplier 3: Mouser; Published: 2008-06-26; RoHS: Y; Value1: 0.1%; MountType: SMT; Supplier 1: Digi-Key; PackageReference: 0603; Tolerance_%: 0.1%; Res_ohm: 49.9; CompType: Resistor; LatestRevisionDate: 2017-03-09; PartNumber: TNPW060349R9BEEA; ComponentLink1Description: Datasheet link; Supplier Part Number 1: 541-2031-1-ND; Technology: Thin Film
R263-R265 R276 R293 R295 R366 R368 = CMP-0026992-3: as R20 on sheet DC309A_CLKGen; CompType: Resistor; PackageReference: 0402; RoHS: Y; Res_ohm: 0; Tolerance_%: 5%; Value1: 5%; MountType: SMT; Technology: Thick Film; SizeY_mm: 0.5; ComponentLink1Description: Datasheet link; ComponentLink1URL: https://industrial.panasonic.com/cdbs/www-data/pdf/RDA0000/AOA0000C301.pdf; Supplier 1: Digi-Key; Supplier Part Number 1: P0.0JCT-ND; Supplier 2: Newark; Supplier Part Number 2: 65T8307; Supplier 3: Mouser; Supplier Part Number 3: 667-ERJ-2GE0R00X; AEC Grade: 0; ValueDisplayed: 0
R266 R267 = CMP-0026453-2: RES, 56.2 k, 1%, 0.063 W, AEC-Q200 Grade 0, 0402; PartNumber: CRCW040256K2FKED; Manufacturer: Vishay-Dale; Value: 56.2k; Value_Code: 56k2; Power_W: 63mW; Value2: 0.063W; VDC_V: 50V; TempCo: 100 ppm/C; SizeArea_mm2: 0.5; SizeX_mm: 1; SizeZ_mm: 0.6; EIA_Code: E96; AEC Category: Q200; AEC Qualified: Y; AEC Grade: 0; CompType: Resistor; PackageReference: 0402; RoHS: E; Res_ohm: 56.2k; Tolerance_%: 1%; Value1: 1%; MountType: SMT; Technology: Thick Film; SizeY_mm: 0.5; ComponentLink1Description: Datasheet link; ComponentLink1URL: http://www.vishay.com/docs/20035/dcrcwe3.pdf; Supplier 1: Digi-Key; Supplier Part Number 1: 541-56.2KLCT-ND; Supplier 2: Newark; Supplier Part Number 2: 52K7159; Supplier 3: Mouser; Supplier Part Number 3: 71-CRCW0402-56.2K-E3
R275 = CMP-0026852-1: RES, 1.0 k, 5%, 0.063 W, 0402; Manufacturer: Vishay-Dale; Power_W: 63mW; TempCo: 200 ppm/C; Value_Code: 1k00; U/M: EA; Value: 1.0k; EIA_Code: E24; Res_ohm: 1k; SizeX_mm: 1; SizeY_mm: 0.5; SizeZ_mm: 0.6; Value2: 0.063W; VDC_V: 50V; AEC Category: Q200; ComponentLink1URL: http://www.vishay.com/docs/20035/dcrcwe3.pdf; Supplier Part Number 2: 59M6691; Publisher: Texas Instruments; Supplier 2: Newark; Supplier Part Number 3: 71-CRCW0402J-1.0K-E3; Supplier 3: Mouser; Published: 2008-06-26; RoHS: Y; Value1: 5%; MountType: SMT; Supplier 1: Digi-Key; PackageReference: 0402; Tolerance_%: 5%; SizeArea_mm2: 0.5; CompType: Resistor; LatestRevisionDate: 2017-03-09; PartNumber: CRCW04021K00JNED; AEC Qualified: ?; ComponentLink1Description: Datasheet link; Supplier Part Number 1: 541-1.0KJCT-ND; Technology: Thick Film
R296 = CMP-0026822-3: RES, 0, 5%, 0.063 W, AEC-Q200 Grade 0, 0402; PartNumber: CRCW04020000Z0ED; Manufacturer: Vishay-Dale; Value: 0; Value_Code: 0000; Power_W: 63mW; Value2: 0.063W; VDC_V: 50V; TempCo: 200 ppm/C; EIA_Code: E24; AEC Category: Q200; AEC Qualified: Y; SizeArea_mm2: 0.5; SizeX_mm: 1; SizeZ_mm: 0.6; CompType: Resistor; PackageReference: 0402; RoHS: E; Res_ohm: 0; Tolerance_%: 5%; Value1: 5%; MountType: SMT; Technology: Thick Film; ComponentLink1Description: Datasheet link; ComponentLink1URL: http://www.vishay.com/docs/20035/dcrcwe3.pdf; Supplier 1: Digi-Key; Supplier Part Number 1: 541-0.0JCT-ND; Supplier 2: Newark; Supplier Part Number 2: 52K6543; Supplier 3: Mouser; Supplier Part Number 3: 71-CRCW0402-0-E3; AEC Grade: 0; SizeY_mm: 0.5
R361 = CMP-0026835-3: RES, 12, 5%, 0.063 W, AEC-Q200 Grade 0, 0402; Manufacturer: Vishay-Dale; Power_W: 63mW; TempCo: 200 ppm/C; Value_Code: 12R0; Value: 12; EIA_Code: E24; SizeX_mm: 1; SizeY_mm: 0.5; SizeZ_mm: 0.6; Value2: 0.063W; AEC Qualified: Y; VDC_V: 50V; AEC Category: Q200; AEC Grade: 0; Supplier Part Number 2: 59M6701; Supplier 2: Newark; Supplier Part Number 3: 71-CRCW0402J-12-E3; Supplier 3: Mouser; RoHS: E; Value1: 5%; MountType: SMT; Supplier 1: Digi-Key; PackageReference: 0402; Tolerance_%: 5%; Res_ohm: 12; SizeArea_mm2: 0.5; CompType: Resistor; PartNumber: CRCW040212R0JNED; ComponentLink1Description: Datasheet link; Supplier Part Number 1: 541-12JCT-ND; Technology: Thick Film; ComponentLink1URL: http://www.vishay.com/docs/20035/dcrcwe3.pdf
R363 = CMP-0119977-1: 100 kOhms 0.5W, 1/2W PC Pins Through Hole Trimmer Potentiometer Cermet 18.0 Turn Top Adjustment; Manufacturer: Nidec Components; SizeZ_mm: 11.3mm; Value: 100kΩ; AEC Qualified: No; TempCo: 100ppm/°C; Tolerance_%: 10%; VDC_V: 300V; PackageReference: PTH_POTEN_9MM6_4MM8; PartNumber: CT-94EW104; RoHS: TRUE; Part Number: CT-94EW104; datasheet: https://www.nidec-components.com/e/catalog/trimmer/ct-94.pdf; Datasheet Path: datasheets/Res-CT-94EW104.pdf; Digikey Description: TRIMMER 100K OHM 0.5W PC PIN TOP; Digikey Part Number: 563-CT-94EW104-ND; helpURL: https://upverter.com/upn/revision/b7c3f4141cf1048a/; Lead Free: Yes; Mouser Part Number: 229-CT-94EW104; Operating Temperature Range: -55°C to +125°C; Power_W: 0.5W; Res_ohm: 100kΩ; Series: CT-94; Technology: Cermet; ComponentLink1Description: Datasheet; ComponentLink1URL: https://www.nidec-components.com/e/catalog/trimmer/ct-94.pdf
TP59 = CMP-0078143-2: TEST POINT.  No entry in BOM.; PackageReference: N/A; CompType: Testpoint; Manufacturer: N/A; PartNumber: N/A; Library Reference: TESTPOINT
U4 = CMP-0052286-1: CMOS Low-Power Monostable/Astable Multivibrator, D0014A, LARGE T&R; Manufacturer: Texas Instruments; VCC(Max)(V): 18; F @ Nom Voltage(Max)(Mhz): 8; tpd @ Nom Voltage(Max)(ns): 450; Rating: Military; Technology Family: CD4000; Output Drive (IOL/IOH)(Max)(mA): 4/-4; Bits(#): 1; VCC(Min)(V): 3; ICC @ Nom Voltage(Max)(mA): 0.06; Voltage(Nom)(V): 10; Generic Part Number: CD4047B; DatasheetVersion: SCHS044C; Output Type: CMOS; Code_JEDEC: MS-012; Input Type: CMOS; Operating Temperature Range(C): -55 to 125; PackageReference: D0014A
U18 U35 = CMP-0051576-2: Low-Power Single 2-Input Positive-AND Gate, DBV0005A (SOT-23-5); Manufacturer: Texas Instruments; 3-State Output: No; Output Type: CMOS; F @ Nom Voltage(Max)(Mhz): 100; Rating: Catalog; Voltage(Nom)(V): 0.8,1.2,1.5,1.8,2.5,3.3; Logic: True; Output Drive (IOL/IOH)(Max)(mA): 20/-20; tpd @ Nom Voltage(Max)(ns): 32.8,20.9,14.2,11,7.6,6.2; Bits(#): 1; ICC @ Nom Voltage(Max)(mA): 0.0009; Gate Type: AND; VCC(Max)(V): 3.6; VCC(Min)(V): 0.8; AEC Category: Q200; AEC Qualified: N; CompType: IC; SizeAreaWB_mm2: 14.82; SizeArea_mm2: 8.12; SizeX_mm: 2.8; SizeY_mm: 2.9; SizeZ_mm: 1.45; PackageReference: DBV0005A; Generic Part Number: SN74AUP1G08; Input Type: CMOS; Schmitt Trigger: No; ComponentLink1Description: Datasheet Link; ComponentLink1URL: http://www.ti.com/lit/ds/symlink/sn74aup1g08.pdf; ComponentLink2Description: Product Folder; ComponentLink2URL: http://www.ti.com/product/sn74aup1g08; ComponentLink3Description: Online Datasheet; ComponentLink3URL: http://www.ti.com/product/sn74aup1g08/datasheet; MountType: SMT; Operating Temperature Range: -40 to 85 C; PackageDescription: SOT-23-5; PartNumber: SN74AUP1G08DBVT; PartId: 1
U36 = CMP-0051642-1: Single Schmitt-Trigger Inverter, DBV0005A, LARGE T&R; Manufacturer: Texas Instruments; Input Type: CMOS/TTL; Output Drive (IOL/IOH)(Max)(mA): 32/-32; VCC(Min)(V): 1.65; 3-State Output: No; Schmitt Trigger: Yes; tpd @ Nom Voltage(Max)(ns): 11,6.5,5.5,5; VCC(Max)(V): 5.5; Output Type: CMOS; Bits(#): 1; Voltage(Nom)(V): 1.8,2.5,3.3,5; Sub-Family: Inverting Buffer/Driver; Logic: Inverting; Technology Family: LVC; F @ Nom Voltage(Max)(Mhz): 150; Rating: Catalog; ICC @ Nom Voltage(Max)(mA): 0.01; DatasheetVersion: SCES218W; PackageReference: DBV0005A; Generic Part Number: SN74LVC1G14; Operating Temperature Range(C): -40 to 125,-40 to 85; PartId: 1
U40 = CMP-0081177-1: Single-Bit Dual-Supply Bus Transceiver, DBV0006A (SOT-23-6); Alternate Manufacturer: Texas Instruments; SizeAreaWB_mm2: 14.82; SizeZ_mm: 1.45; SizeX_mm: 2.8; SizeY_mm: 2.9; SizeArea_mm2: 8.12; CompType: IC; AEC Qualified: N; AEC Category: Q200; ComponentLink1URL: http://www.ti.com/lit/ds/symlink/sn74axc1t45.pdf; PackageDescription: SOT-23-6; MountType: SMT; ComponentLink2URL: http://www.ti.com/product/sn74axc1t45; ComponentLink3Description: Online Datasheet; ComponentLink2Description: Product Folder; Manufacturer: Texas Instruments; ComponentLink3URL: http://www.ti.com/product/sn74axc1t45/datasheet; PackageReference: DBV0006A; PartNumber: SN74AXC1T45DBVR; ComponentLink1Description: Datasheet Link
U41 = CMP-0076021-2: 2 Gbps LVDS/LVPECL/CML to LVDS Buffer/Repeater/Translator, DGK0008A (VSSOP-8); PartNumber: SN65LVDS100DGKR; Alternate PartNumber: SN65LVDS100DGK; Manufacturer: Texas Instruments; SizeArea_mm2: 14.7; SizeAreaWB_mm2: 23.6; SizeX_mm: 4.9; SizeY_mm: 3; SizeZ_mm: 1.1; CompType: IC; AEC Category: Q200; AEC Qualified: N; PackageReference: DGK0008A; PackageDescription: VSSOP-8; MountType: SMT; ComponentLink1Description: Datasheet Link; ComponentLink1URL: http://www.ti.com/lit/ds/symlink/sn65lvds100.pdf; RoHS: Y; Alternate Manufacturer: Texas Instruments; Code_JEDEC: MO-187-AA; ComponentLink2Description: Product Folder; ComponentLink2URL: http://www.ti.com/product/sn65lvds100; ComponentLink3Description: Online Datasheet; ComponentLink3URL: http://www.ti.com/product/sn65lvds100/datasheet
U42 = CMP-0051197-2: Low-Power Dual Positive-Edge-Triggered D-Type Flip-Flop, DCU0008A (VSSOP-8); Manufacturer: Texas Instruments; ICC @ Nom Voltage(Max)(mA): 0.0009; 3-State Output: No; Input Type: CMOS; Rating: Catalog; Output Drive (IOL/IOH)(Max)(mA): 20/-20; VCC(Max)(V): 3.6; Bits(#): 2; Technology Family: AUP; Logic: True; Voltage(Nom)(V): 0.8,1.2,1.5,1.8,2.5,3.3; VCC(Min)(V): 0.8; tpd @ Nom Voltage(Max)(ns): 27.2,17.3,13.3,11.3,7.8,6.3; F @ Nom Voltage(Max)(Mhz): 100; AEC Category: Q200; AEC Qualified: N; CompType: IC; SizeAreaWB_mm2: 12.6; SizeArea_mm2: 6.4; SizeX_mm: 3.2; SizeY_mm: 2.0; SizeZ_mm: 0.9; Generic Part Number: SN74AUP2G79; PackageReference: DCU0008A; Schmitt Trigger: No; Output Type: CMOS; ComponentLink1Description: Datasheet Link; ComponentLink1URL: http://www.ti.com/lit/ds/symlink/sn74aup2g79.pdf; ComponentLink2Description: Product Folder; ComponentLink2URL: http://www.ti.com/product/sn74aup2g79; ComponentLink3Description: Online Datasheet; ComponentLink3URL: http://www.ti.com/product/sn74aup2g79/datasheet; MountType: SMT; Operating Temperature Range: -40 to 85 C; PackageDescription: VSSOP-8; PartNumber: SN74AUP2G79DCUR; PartId: 1